# Altium project Telemetry_Board.PrjPcb
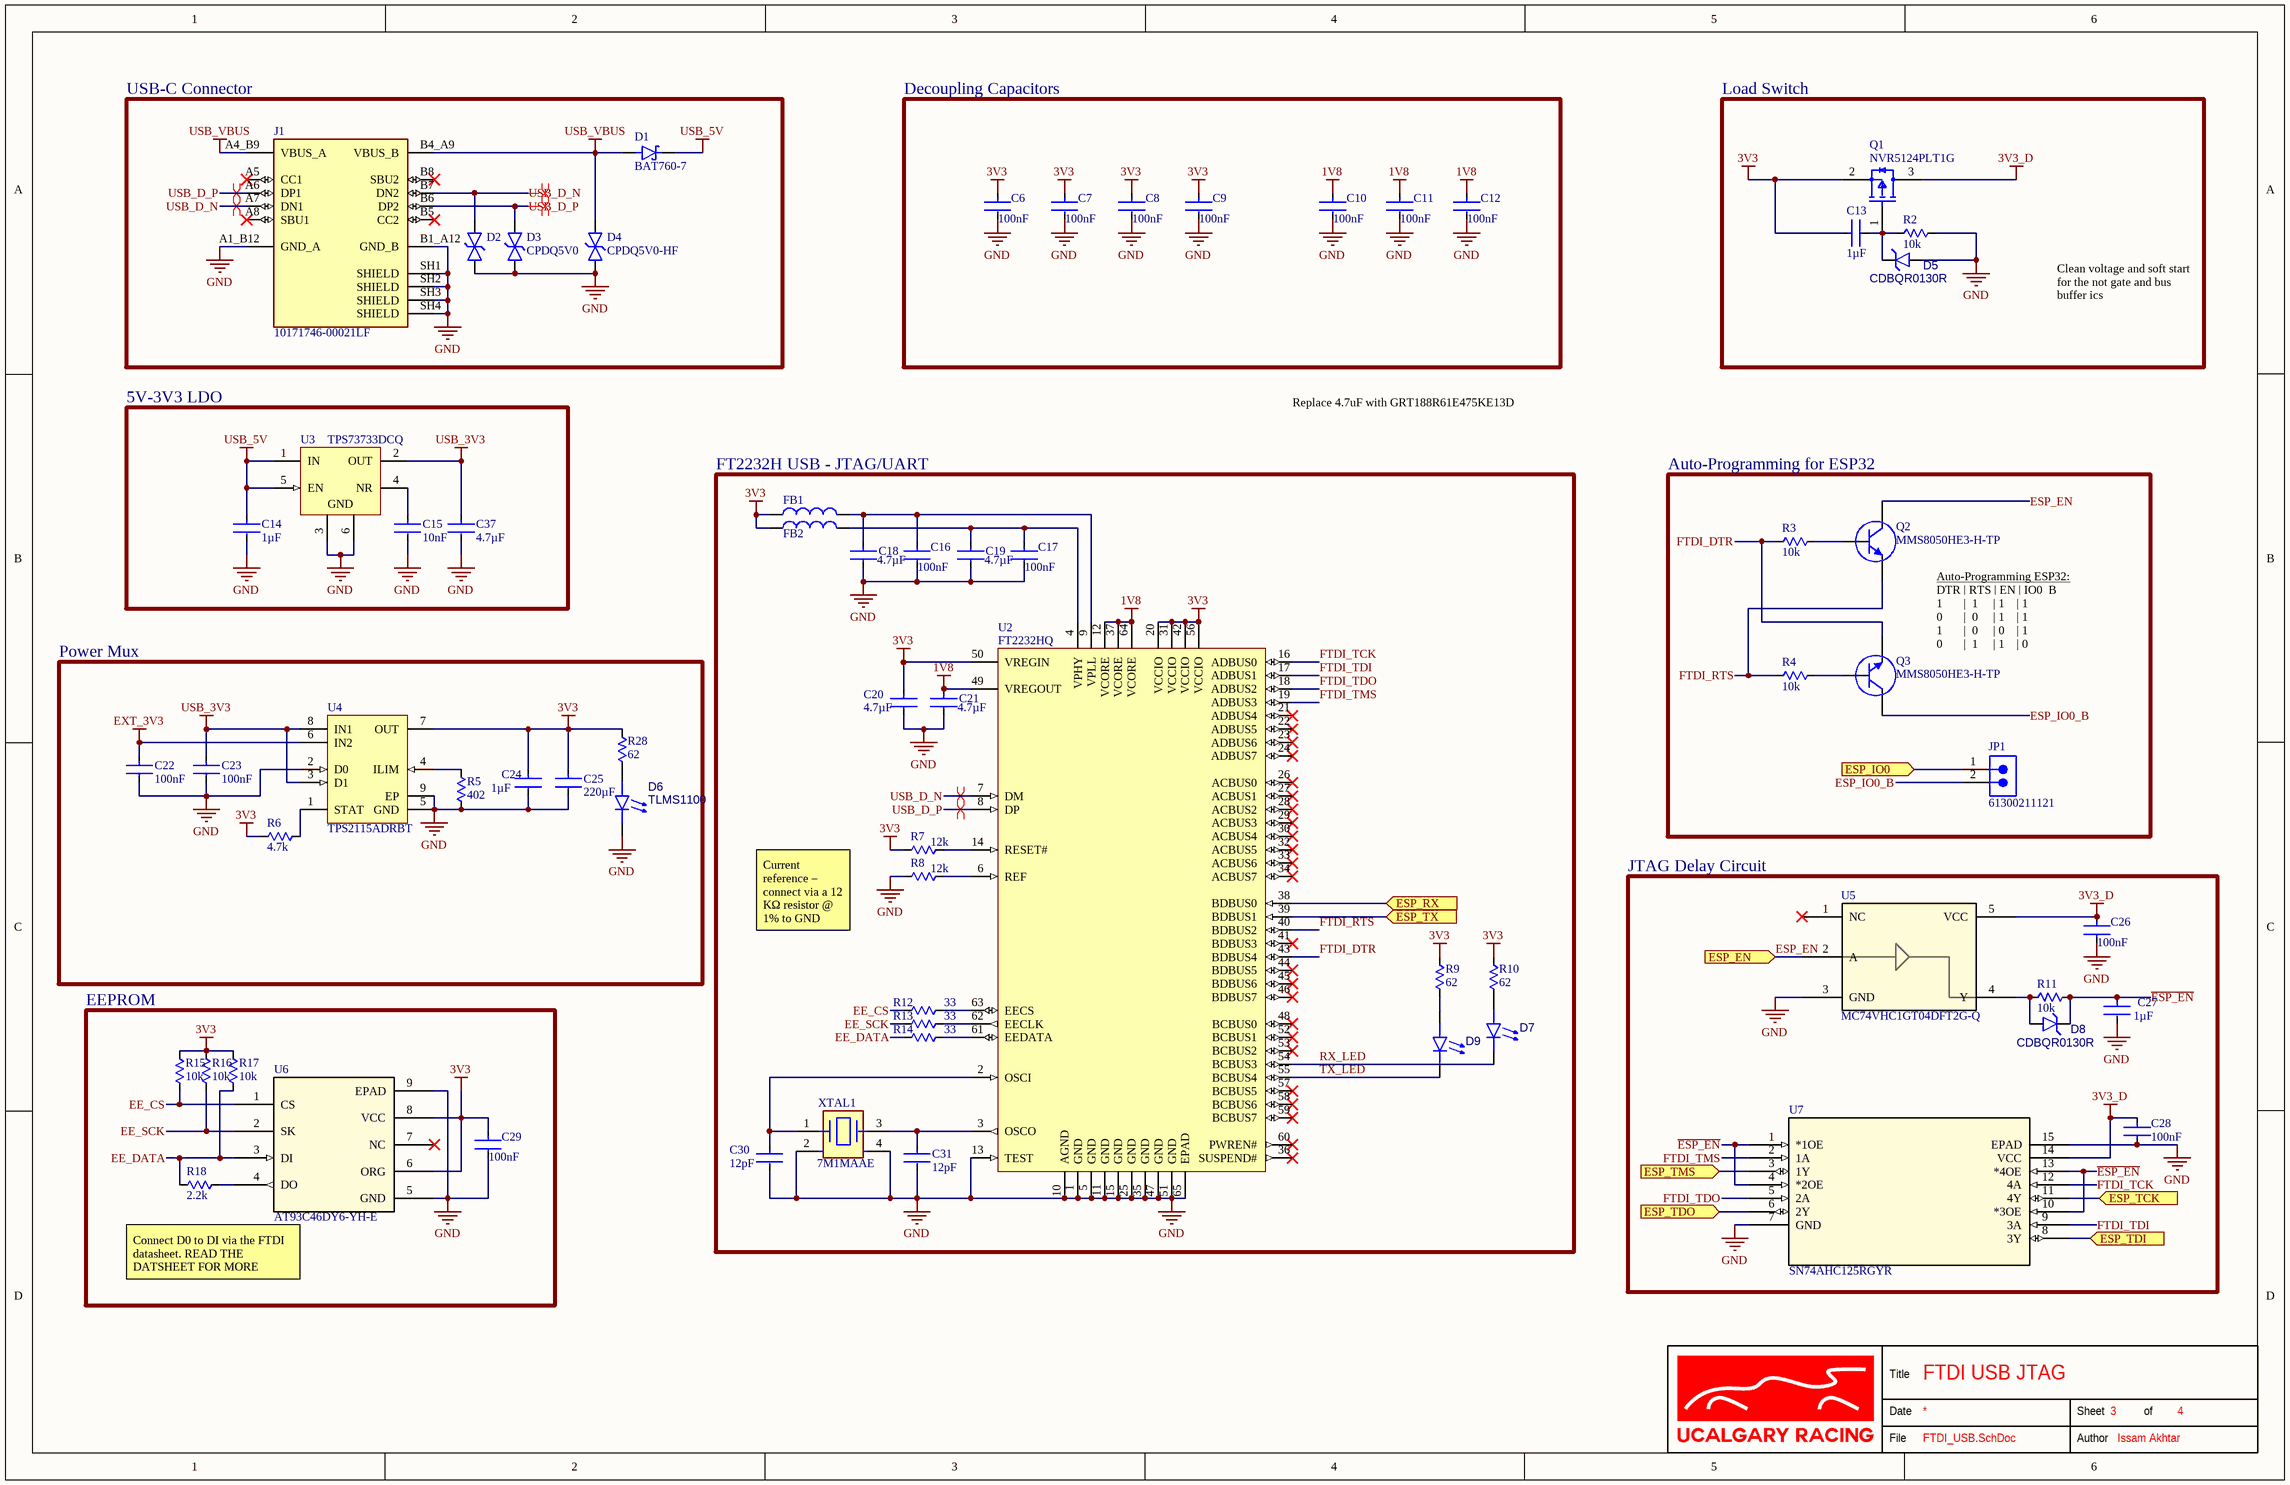
[diagram p0: FTDI_USB.SchDoc]
2 sheets, 87 parts. Net scope: flat (ports and power ports of the same name join across sheets).
Board file: Telemetry_Board.PcbDoc
Sheets:
  FTDI_USB.SchDoc
  CAN_Controller.SchDoc

## Sheet FTDI_USB.SchDoc: FTDI USB JTAG
size 431 x 279 mm; Author: Issam Akhtar; SheetNumber: 3; SheetTotal: 4; SPICEModelCacheJSEMETTS: <root> / <DocumentId>JSEMETTS</DocumentId> / <CacheFrame Number="0"> / <Model Name="emk107b7105_aht" Kind="CKT"> / <Text>* EMK107B7105_AHT     SPICE MODEL  ( General Type ) / *-------------------------------------------------------------------------------------------------------- / * Model Generated by TAIYO YUDEN Corporation (http://www.ty-top.com) / * Version 1.0 / * TAIYO YUDEN Control No. 170508_121019 / * Copyright(c) 2012 TAIYO YUDEN CO.,LTD. All Rights Reserved. / *-------------------------------------------------------------------------------------------------------- / * / * Products Name : Multilayer Ceramic Capacitors / * / * Characteristics : / *     Capacitance : 1 uF , Rated Voltage : 16V , TCC : X7R / *     Case Size : 1.6 x 0.8 / 0.063 x 0.031 [mm/inch] , Thickness : 0.8 / 0.031 [mm/inch] / *     (Conditions: Temperature = 25 degC , DC Bias Current/Voltage = 0A / 0V) / * / * Frequency Range : 40Hz - 3GHz / * / * External Node Assignments : / * / *  1  o---| |---o  2 / * / *-------------------------------------------------------------------------------------------------------- / .SubCkt EMK107B7105_AHT 1 2 / **************************** / C0 1 110 0.80758u / Cm 1 101 0.092139u / C1 101 102 0.1852u / Rc1 101 102 2.7949k / C2 102 103 0.056297u / Rc2 102 103 290.22 / C3 103 110 0.052208u / Rc3 103 110 21.398 / C2m 1 301 0.15431u / C21 301 302 0.36455u / Rc21 301 302 10.682k / C22 302 303 0.40822u / Rc22 302 303 6.1869k / C23 303 304 0.48384u / Rc23 303 304 2.563k / C24 304 305 0.20172u / Rc24 304 305 458.05 / C25 305 306 0.12781u / Rc25 305 306 666.09 / C26 306 307 0.31895u / Rc26 306 307 21.434 / C27 307 308 0.18632u / Rc27 307 308 35.28 / C28 308 309 0.057576u / Rc28 308 309 60.428 / C29 309 110 5787.8p / Rc29 309 110 9.6675 / Rp0 1 110 100Meg / L0 110 120 0.29644n / Lm 120 130 0.15574n / L1 120 121 0.20382n / RL1 121 130 0.16236 / L2 120 122 0.33815n / RL2 122 130 0.3166 / L3 120 123 0.86499n / RL3 123 130 0.84214 / CR 120 124 0.21823u / LR 124 125 0.13885n / RR 125 130 36.232m / CL 130 140 1.9321p / LL 130 140 0.19616n / RL 130 140 44.967 / Rs 140 2 6.428m / **************************** / .ends EMK107B7105_AHT</Text> / </Model> / </CacheFrame> / </root>

### Parts
C6  value 100nF  [FP-CL10-IPC_B]  (hidden comment: CL10B104KB8WPNC)
C7  value 100nF  [FP-CL10-IPC_B]  (hidden comment: CL10B104KB8WPNC)
C8  value 100nF  [FP-CL10-IPC_B]  (hidden comment: CL10B104KB8WPNC)
C9  value 100nF  [FP-CL10-IPC_B]  (hidden comment: CL10B104KB8WPNC)
C10  value 100nF  [FP-CL10-IPC_B]  (hidden comment: CL10B104KB8WPNC)
C11  value 100nF  [FP-CL10-IPC_B]  (hidden comment: CL10B104KB8WPNC)
C12  value 100nF  [FP-CL10-IPC_B]  (hidden comment: CL10B104KB8WPNC)
C13  value 1µF  [FP-CL10-IPC_B]  (hidden comment: CL10B105KA8NNNC)
C14  value 1µF  [FP-0603-L_1_6_0_1-W_0_8_0-IPC_B]  (hidden comment: EMK107B7105KAHT)
C15  value 10nF  [FP-C0603C103K9RACTU-IPC_A]  (hidden comment: C0603C103K9RACTU)
C16  value 100nF  [FP-CL10-IPC_B]  (hidden comment: CL10B104KB8WPNC)
C17  value 100nF  [FP-CL10-IPC_B]  (hidden comment: CL10B104KB8WPNC)
C18  value 4.7µF  [FP-CL10-IPC_B]  (hidden comment: CL10A475KA8NQNC)
C19  value 4.7µF  [FP-CL10-IPC_B]  (hidden comment: CL10A475KA8NQNC)
C20  value 4.7µF  [FP-CL10-IPC_B]  (hidden comment: CL10A475KA8NQNC)
C21  value 4.7µF  [FP-CL10-IPC_B]  (hidden comment: CL10A475KA8NQNC)
C22  value 100nF  [FP-CL10-IPC_B]  (hidden comment: CL10B104KB8WPNC)
C23  value 100nF  [FP-CL10-IPC_B]  (hidden comment: CL10B104KB8WPNC)
C24  value 1µF  [FP-CL10-IPC_B]  (hidden comment: CL10B105KA8NNNC)
C25  value 220µF  [FP-GRM31C-0_3-e0_3_0_9-IPC_C]  (hidden comment: GRM31CR60J227ME11K)
C26  value 100nF  [FP-CL10-IPC_B]  (hidden comment: CL10B104KB8WPNC)
C27  value 1µF  [FP-CL10-IPC_B]  (hidden comment: CL10B105KA8NNNC)
C28  value 100nF  [FP-CL10-IPC_B]  (hidden comment: CL10B104KB8WPNC)
C29  value 100nF  [FP-CL10-IPC_B]  (hidden comment: CL10B104KB8WPNC)
C30  value 12pF  [FP-CL10-IPC_B]  (hidden comment: CL10C120JB81PNC)
C31  value 12pF  [FP-CL10-IPC_B]  (hidden comment: CL10C120JB81PNC)
C37  value 4.7µF  [FP-CL10-IPC_B]  (hidden comment: CL10A475KQ8NNNC)
D1  BAT760-7  [SOD2513X120N]
D2  CPDQ5V0-HF  [CPDQ5V0-HF-Footprint-1]  (value not drawn)
D3  CPDQ5V0  [CPDQ5V0-HF-Footprint-1]
D4  CPDQ5V0-HF  [CPDQ5V0-HF-Footprint-1]
D5  CDBQR0130R  [CDBQR0130R-Footprint-1]
D6  TLMS1100  [TLMS1100-GS15-Footprint-1]
D7  TLMO1100-GS15  [TLMS1100-GS15-Footprint-1]  (value not drawn)
D8  CDBQR0130R  [CDBQR0130R-Footprint-1]
D9  TLMG1100-GS15  [TLMS1100-GS15-Footprint-1]  (value not drawn)
FB1  BLM18SP102SH1D  [FP-BLM18-0_15-t0_8-IPC_C]  (value not drawn)
FB2  BLM18SP102SH1D  [FP-BLM18-0_15-t0_8-IPC_C]  (value not drawn)
J1  10171746-00021LF  [AMPHENOL_10171746-00021LF]
JP1  61300211121  [61300211121]
Q1  NVR5124PLT1G  [FP-318-08-IPC_C]
Q2  MMS8050HE3-H-TP  [MMS8050HE3-H-TP-Footprint-1]
Q3  MMS8050HE3-H-TP  [MMS8050HE3-H-TP-Footprint-1]
R2  value 10k  [FP-CRCW0603-e3-IPC_B]  (hidden comment: CRCW060310K0FKEA)
R3  value 10k  [FP-CRCW0603-e3-IPC_B]  (hidden comment: CRCW060310K0FKEA)
R4  value 10k  [FP-CRCW0603-e3-IPC_B]  (hidden comment: CRCW060310K0FKEA)
R5  value 402  [FP-CRCW0603-e3-IPC_B]  (hidden comment: CRCW0603402RFKEA)
R6  value 4.7k  [FP-CRCW0603-e3-IPC_B]  (hidden comment: CRCW06034K70FKEA)
R7  value 12k  [FP-ERA3A-IPC_B]  (hidden comment: ERA-3AEB123V)
R8  value 12k  [FP-ERA3A-IPC_B]  (hidden comment: ERA-3AEB123V)
R9  value 62  [RESC1508X50N]  (hidden comment: RCS060362R0FKEA)
R10  value 62  [RESC1508X50N]  (hidden comment: RCS060362R0FKEA)
R11  value 10k  [FP-CRCW0603-e3-IPC_B]  (hidden comment: CRCW060310K0FKEA)
R12  value 33  [FP-CRCW0603-e3-IPC_C]  (hidden comment: CRCW060333R0FKEA)
R13  value 33  [FP-CRCW0603-e3-IPC_C]  (hidden comment: CRCW060333R0FKEA)
R14  value 33  [FP-CRCW0603-e3-IPC_C]  (hidden comment: CRCW060333R0FKEA)
R15  value 10k  [FP-CRCW0603-e3-IPC_B]  (hidden comment: CRCW060310K0FKEA)
R16  value 10k  [FP-CRCW0603-e3-IPC_B]  (hidden comment: CRCW060310K0FKEA)
R17  value 10k  [FP-CRCW0603-e3-IPC_B]  (hidden comment: CRCW060310K0FKEA)
R18  value 2.2k  [FP-CRCW0603-e3-IPC_B]  (hidden comment: CRCW06032K20FKEA)
R28  value 62  [RESC1508X50N]  (hidden comment: RCS060362R0FKEA)
U2  FT2232HQ  [FP-FT2232HQ-Reel-MFG]
U3  TPS73733DCQ  [DCQ0006A_N]
U4  TPS2115ADRBT  [DRB0008B_V]
U5  MC74VHC1GT04DFT2G-Q  [MC74VHC1GT04DFT2G-Q-Footprint-1]
U6  AT93C46DY6-YH-E  [AT93C46DY6-YH-E-Footprint-1]
U7  SN74AHC125RGYR  [RGY0014A_V]
XTAL1  7M1MAAE  [FP-7M-MFG]

### Blocks framed on the sheet
USB-C Connector: D1-D4 J1
Decoupling Capacitors: C6-C12
Load Switch: C13 D5 Q1 R2
5V-3V3 LDO: C14 C15 C37 U3
FT2232H USB - JTAG/UART: C16-C21 C30 C31 D7 D9 FB1 FB2 R7-R10 R12-R14 U2 XTAL1
Auto-Programming for ESP32: JP1 Q2 Q3 R3 R4
Power Mux: C22-C25 D6 R5 R6 R28 U4
JTAG Delay Circuit: C26-C28 D8 R11 U5 U7
EEPROM: C29 R15-R18 U6

### Ports
ESP_EN (in, see Telemetry_Module[3C], ESP32[2B], ESP32[3B]), ESP_IO0 (in, see Telemetry_Module[3C], ESP32[2B], ESP32[5B]), ESP_RX (in, see Telemetry_Module[3B], ESP32[5B]), ESP_TCK (in, see Telemetry_Module[3B], ESP32[5B]), ESP_TDI (in, see Telemetry_Module[3B], ESP32[5B]), ESP_TDO (in, see Telemetry_Module[3B], ESP32[5B]), ESP_TMS (in, see Telemetry_Module[3B], ESP32[5B]), ESP_TX (in, see Telemetry_Module[3B], ESP32[5B])

### Nets
1V8: C10.1 C11.1 C12.1 C21.1 U2.12(VCORE) U2.37(VCORE) U2.49(VREGOUT) U2.64(VCORE)
3V3: C6.1 C7.1 C8.1 C9.1 C13.1 C20.1 C24.1 C25.1 C29.1 FB1.1 FB2.1 Q1.2(S) R6.1 R7.1 R9.2 R10.2 R15.2 R16.2 R17.2 R28.2 U2.20(VCCIO) U2.31(VCCIO) U2.42(VCCIO) U2.50(VREGIN) U2.56(VCCIO) U4.7(OUT) U6.6(ORG) U6.8(VCC)
3V3_D: C26.1 C28.1 Q1.3(D) U5.5(VCC) U7.14(VCC)
EXT_3V3: C22.1 U4.6(IN2)
GND: C6.2 C7.2 C8.2 C9.2 C10.2 C11.2 C12.2 C14.2 C15.2 C16.2 C17.2 C18.2 C19.2 C20.2 C21.2 C22.2 C23.2 C24.2 C25.2 C26.2 C27.2 C28.2 C29.2 C30.2 C31.2 C37.2 D2.1(C) D3.1(C) D4.1(C) D5.2(A) D6.1(K) J1.A1_B12(GND_A) J1.B1_A12(GND_B) J1.SH1(SHIELD) J1.SH2(SHIELD) J1.SH3(SHIELD) J1.SH4(SHIELD) R2.1 R5.2 R8.1 U2.1(GND) U2.5(GND) U2.10(AGND) U2.11(GND) U2.13(TEST) U2.15(GND) U2.25(GND) U2.35(GND) U2.47(GND) U2.51(GND) U2.65(EPAD) U3.3(GND) U3.6(GND) U4.2(D0) U4.5(GND) U4.9(EP) U5.3(GND) U6.5(GND) U6.9(EPAD) U7.7(GND) U7.15(EPAD) XTAL1.2(GND) XTAL1.4(GND)
USB_3V3: C23.1 C37.1 U3.2(OUT) U4.3(D1) U4.8(IN1)
USB_5V: C14.1 D1.C(K) U3.1(IN) U3.5(EN)
USB_VBUS: D1.A D4.2(A) J1.A4_B9(VBUS_A) J1.B4_A9(VBUS_B)
~{ESP_EN}: C27.1 D8.1(K) R11.1 U7.1(*1OE) U7.4(*2OE) U7.10(*3OE) U7.13(*4OE)
EE_CS: R12.1 R15.1 U6.1(CS)
EE_DATA: R14.1 R17.1 R18.1 U6.3(DI)
EE_SCK: R13.1 R16.1 U6.2(SK)
ESP_EN: Q2.2(C) U5.2(A) ; port ESP_EN
ESP_IO0_B: JP1.2 Q3.2(C)
FTDI_DTR: Q3.3(E) R3.2 U2.43(BDBUS4)
FTDI_RTS: Q2.3(E) R4.2 U2.40(BDBUS2)
FTDI_TCK: U2.16(ADBUS0) U7.12(4A)
FTDI_TDI: U2.17(ADBUS1) U7.9(3A)
FTDI_TDO: U2.18(ADBUS2) U7.5(2A)
FTDI_TMS: U2.19(ADBUS3) U7.2(1A)
RX_LED: D7.1(K) U2.54(BCBUS3)
TX_LED: D9.1(K) U2.55(BCBUS4)
USB_D_N: D2.2(A) J1.A7(DN1) J1.B7(DN2) U2.7(DM)
USB_D_P: D3.2(A) J1.A6(DP1) J1.B6(DP2) U2.8(DP)
NetC13_2: C13.2 D5.1(K) Q1.1(G) R2.2
NetC15_1: C15.1 U3.4(NR)
NetC16_1: C16.1 C18.1 FB1.2 U2.9(VPLL)
NetC17_1: C17.1 C19.1 FB2.2 U2.4(VPHY)
NetC30_1: C30.1 U2.2(OSCI) XTAL1.1
NetC31_1: C31.1 U2.3(OSCO) XTAL1.3
NetD6_2: D6.2(A) R28.1
NetD7_2: D7.2(A) R10.1
NetD8_2: D8.2(A) R11.2 U5.4(Y)
NetD9_2: D9.2(A) R9.1
NetJP1_1: JP1.1 ; port ESP_IO0
NetQ2_1: Q2.1(B) R3.1
NetQ3_1: Q3.1(B) R4.1
NetR5_1: R5.1 U4.4(ILIM)
NetR6_2: R6.2 U4.1(STAT)
NetR7_2: R7.2 U2.14(RESET#)
NetR8_2: R8.2 U2.6(REF)
NetR12_2: R12.2 U2.63(EECS)
NetR13_2: R13.2 U2.62(EECLK)
NetR14_2: R14.2 U2.61(EEDATA)
NetR18_2: R18.2 U6.4(DO)
NetU2_38: U2.38(BDBUS0) ; port ESP_RX
NetU2_39: U2.39(BDBUS1) ; port ESP_TX
NetU7_3: U7.3(1Y) ; port ESP_TMS
NetU7_6: U7.6(2Y) ; port ESP_TDO
NetU7_8: U7.8(3Y) ; port ESP_TDI
NetU7_11: U7.11(4Y) ; port ESP_TCK

Not connected (* = marked no-connect by the designer): J1 A5(CC1)* A8(SBU1)* B5(CC2)* B8(SBU2)*; U2 21(ADBUS4)* 22(ADBUS5)* 23(ADBUS6)* 24(ADBUS7)* 26(ACBUS0)* 27(ACBUS1)* 28(ACBUS2)* 29(ACBUS3)* 30(ACBUS4)* 32(ACBUS5)* 33(ACBUS6)* 34(ACBUS7)* 36(SUSPEND#)* 41(BDBUS3)* 44(BDBUS5)* 45(BDBUS6)* 46(BDBUS7)* 48(BCBUS0)* 52(BCBUS1)* 53(BCBUS2)* 57(BCBUS5)* 58(BCBUS6)* 59(BCBUS7)* 60(PWREN#)*; U5 1(NC)*; U6 7(NC)*

### Layout directives
differential pair: USB_D_N, USB_D_P

### Notes on the sheet
- Clean voltage and soft start for the not gate and bus buffer ics
- Replace 4.7uF with GRT188R61E475KE13D
- Auto-Programming ESP32:
  DTR | RTS | EN | IO0_B
- 1       |  1     | 1    | 1
  0       |  0     | 1    | 1
  1       |  0     | 0    | 1
  0       |  1     | 1    | 0
- Current reference – connect via a 12 KΩ resistor @ 1% to GND
- Connect D0 to DI via the FTDI datasheet. READ THE DATSHEET FOR MORE
- Title
- Date
- Sheet
- of
- File
- Author

### Library data of the parts
C6-C12 C16 C17 C22 C23 C26 C28 C29 = CMP-001-00005-5: 0.1 µF ±10% 50V Ceramic Capacitor X7R 0603 (1608 Metric); Case/Package: 0603; Min Operating Temperature: -55°C; Mounting Technology: Surface Mount; Pins: 2; Max Operating Temperature: 125°C; Capacitor Type: Ceramic; Voltage Rating: 50V
C13 C24 C27 = CMP-001-00021-3: 1 µF ±10% 25V Ceramic Capacitor X7R 0603 (1608 Metric); RoHS Compliant: Yes; Min Operating Temperature: -55°C; Height: 0.9mm; Capacitor Type: Ceramic; Voltage Rating: 25V; Case/Package: 0603; Tolerance: 10%; Mounting Technology: Surface Mount; Pins: 2; Rated DC Voltage (URdc): 25V; Max Operating Temperature: 125°C
C14 = CMP-001-00032-1: Ceramic Capacitor, Multilayer, Ceramic, 16V, 10% +Tol, 10% -Tol, X7R, 15% TC, 1uF, Surface Mount, 0603; Case/Package: 0603; Pins: 2; Capacitor Type: Ceramic; Max Operating Temperature: 125°C; Mounting Technology: Surface Mount; Min Operating Temperature: -55°C; RoHS Compliant: Yes
C15 = CMP-001-00029-1: Ceramic Capacitor, Multilayer, Ceramic, 6.3V, 10% +Tol, 10% -Tol, X7R, 15% TC, 0.01uF, Surface Mount, 0603; Pins: 2; Capacitor Type: Ceramic; RoHS Compliant: Yes; Min Operating Temperature: -55°C; Max Operating Temperature: 125°C; Case/Package: 0603; Mounting Technology: Surface Mount
C18-C21 = CMP-001-00082-1: Ceramic Capacitor, Multilayer, Ceramic, 25V, 10% +Tol, 10% -Tol, X5R, 15% TC, 4.7uF, Surface Mount, 0603; Case/Package: 0603; Pins: 2; Min Operating Temperature: -55°C; RoHS Compliant: Yes; Mounting Technology: Surface Mount; Capacitor Type: Ceramic; Max Operating Temperature: 85°C
C25 = CMP-001-00087-1: Ceramic Capacitor, Multilayer, Ceramic, 6.3V, 20% +Tol, 20% -Tol, X5R, 15% TC, 220uF, Surface Mount, 1206; Min Operating Temperature: -55°C; Rated DC Voltage (URdc): 6.3V; Max Operating Temperature: 85°C; Pins: 2; Mounting Technology: Surface Mount; Case/Package: 1206; Capacitor Type: Ceramic; RoHS Compliant: Yes
C30 C31 = CMP-001-00083-1: Ceramic Capacitor, Multilayer, Ceramic, 50V, 5% +Tol, 5% -Tol, C0G, -/+30ppm/Cel TC, 0.000012uF, Surface Mount, 0603; Case/Package: 0603; Capacitor Type: Ceramic; Pins: 2; Rated DC Voltage (URdc): 50V; RoHS Compliant: Yes; Min Operating Temperature: -55°C; Max Operating Temperature: 125°C; Mounting Technology: Surface Mount
C37 = CMP-001-00016-4: 4.7 µF ±10% 6.3V Ceramic Capacitor X5R 0603 (1608 Metric); Tolerance: 10%; Mounting Technology: Surface Mount; Min Operating Temperature: -55°C; Voltage Rating: 6.3V; Case/Package: 0603; Max Operating Temperature: 85°C; Capacitor Type: Ceramic; RoHS Compliant: Yes; Pins: 2
D1 = CMP-004-00029-2: Diode Schottky 30V 1A 2-Pin SOD-323 T/R; MF: Diodes Zetex; BuyPart: https://www.snapeda.com/parts/BAT760-7/Zetex/view-part/4817231/?ref=eda; Design Item ID: BAT760-7; Case/Package: None; Mouser-Purchase-URL: https://snapeda.com/shop?store=Mouser&id=4817231; DigiKey-Purchase-URL: https://snapeda.com/shop?store=DigiKey&id=4817231; Component Type: Standard; Price: None; Availability: Good; MP: BAT760-7; Value: *; SnapEDA_Link: https://www.snapeda.com/parts/BAT760-7/Zetex/view-part/4817231/?ref=snap; Pins: 2; Source: BAT760-7.SchLib
D2-D4 = CMP-004-00030-1: Trans Voltage Suppressor Diode, 174W, 5V V(RWM), Bidirectional, 1 Element, Silicon; Breakdown Voltage-Nom: 5.6V; Clamping Voltage-Max: 18.6V; Diode Type: TRANS VOLTAGE SUPPRESSOR; Polarity: Bidirectional; Reach SVHC Compliant: Yes; RoHS Compliant: Yes; Rep Pk Reverse Voltage-Max: 5V
D5 D8 = CMP-004-00031-1: Rectifier Diode, Schottky, 1 Phase, 1 Element, 0.1A, 35V V(RRM), Silicon; Max Output current: 100mA; Forward Voltage: 450mV; Diode Type: RECTIFIER; RoHS Compliant: Yes; Pins: 2; Package Style: SMALL OUTLINEMeter; Max Operating Temperature: 125°C
D6 = CMP-007-00006-1: Single Color LED, Red, 1.6mm; RoHS Compliant: Yes
D7 = CMP-007-00007-1: Led, Orange, 80Mcd, 606Nm, 0603 Rohs Compliant: Yes
D9 = CMP-007-00008-1: Single Color LED, Green, 1.6mm; RoHS Compliant: Yes
FB1 FB2 = CMP-006-00012-1: Ferrite Chip, 1 Function(s), 0.8A, 2 Pin(s)
J1 = CMP-002-00084-1: USB-C (USB TYPE-C) USB 2.0 Receptacle Connector 24 (6+18 Dummy) Position Surface Mount, Right Angle; Through Hole; MF: Amphenol; MP: 10171746-00021LF; Design Item ID: 10171746-00021LF; Component Type: Standard; Case/Package: None; Pins: 16; Check_prices: https://www.snapeda.com/parts/10171746-00021LF/Amphenol/view-part/?ref=eda; Value: *; Source: 10171746-00021LF.SchLib; SnapEDA_Link: https://www.snapeda.com/parts/10171746-00021LF/Amphenol/view-part/?ref=snap
JP1 = CMP-002-00077-1: Board Connector, 2 Contact(s), 1 Row(s), Male, Straight, 0.1 inch Pitch, Solder Terminal, Locking, Black Insulator, Plug; Connector Type: BOARD CONNECTOR; Min Operating Temperature: -40°C; Max Operating Temperature: 125°C; Mounting Technology: Board; RoHS Compliant: Yes
Q1 = CMP-013-00025-1: Small Signal Field-Effect Transistor, 1.1A I(D), 60V, 1-Element, P-Channel, Silicon, Metal-oxide Semiconductor FET, TO-236; RoHS Compliant: Yes
Q2 Q3 = CMP-013-00024-1: NPN Signal Transistor, SOT-23
R2-R4 R11 R15-R17 = CMP-009-00002-2: 10 kOhms ±1% 0.1W, 1/10W Chip Resistor 0603 (1608 Metric) Automotive AEC-Q200 Thick Film; Voltage Rating: 75V; Power: 100mW; Mounting Technology: Surface Mount; Max Operating Temperature: 155°C; Pins: 2; Min Operating Temperature: -55°C; Tolerance: 1%; Case/Package: 0603
R5 = CMP-009-00007-3: 402 Ohms ±1% 0.1W, 1/10W Chip Resistor 0603 (1608 Metric) Automotive AEC-Q200 Thick Film; Power: 100mW; Voltage Rating: 75V; Min Operating Temperature: -55°C; Mounting Technology: Surface Mount; Tolerance: 1%; Max Operating Temperature: 155°C; Pins: 2; Case/Package: 0603; RoHS Compliant: Yes
R6 = CMP-009-00003-3: 4.7 kOhms ±1% 0.1W, 1/10W Chip Resistor 0603 (1608 Metric) Automotive AEC-Q200 Thick Film; Power: 100mW; Voltage Rating: 75V; Max Operating Temperature: 155°C; Min Operating Temperature: -55°C; Mounting Technology: Surface Mount; Pins: 2; Tolerance: 1%; Case/Package: 0603
R7 R8 = CMP-009-00044-3: Fixed Resistor, Thin Film, 0.1W, 12000ohm, 75V, 0.1% +/-Tol, 25ppm/Cel, Surface Mount, 0603; Power: 100mW; Rated Temperature: 85°C; Package Height: 0.45mm; Mounting Technology: Surface Mount; Tolerance: 0.1%; Case/Package: 0603; Working Voltage: 75V; Min Operating Temperature: -55°C; RoHS Compliant: Yes; Max Operating Temperature: 155°C
R9 R10 R28 = CMP-009-00180-2: Case/Package: None; Pins: 2; Component Type: Standard; MP: RCS060362R0FKEA; Design Item ID: RCS060362R0FKEA; Availability: Unavailable; Price: None; Source: RCS060362R0FKEA.SchLib
R12-R14 = CMP-009-00183-1: Fixed Resistor, Metal Glaze/thick Film, 0.1W, 33ohm, 75V, 1% +/-Tol, 100ppm/Cel, Surface Mount, 0603; Power: 100mW; Pins: 2; RoHS Compliant: Yes; Tolerance: 1%; Mounting Technology: Surface Mount; Min Operating Temperature: -55°C; Working Voltage: 75V; Max Operating Temperature: 155°C; Case/Package: 0603
R18 = CMP-009-00147-1: 2.2 kOhms ±1% 0.1W, 1/10W Chip Resistor 0603 (1608 Metric) Automotive AEC-Q200 Thick Film; Voltage Rating: 75V; Power: 100mW; Tolerance: 1%; Case/Package: 0603; Mounting Technology: Surface Mount; Max Operating Temperature: 155°C; Pins: 2; Min Operating Temperature: -55°C; RoHS Compliant: Yes
U2 = CMP-015-00005-2: USB Bus Controller, CMOS, PQCC64; Max Supply Voltage: 1.98V; Min Supply Voltage: 1.62V; Nominal Supply Voltage: 1.8V; Min Operating Temperature: -40°C; Max Operating Temperature: 85°C; RoHS Compliant: Yes; Case/Package: HVQCCN; Pins: 64
U3 = CMP-019-00028-1: Fixed Positive LDO Regulator, 3.3V, 0.5V Dropout, BICMOS, PDSO6; Max Supply Voltage: 5.5V; Case/Package: SOP; RoHS Compliant: Yes; Pins: 6
U4 = CMP-019-00031-1: Power Supply Support Circuit, Adjustable, 2 Channel, PDSO8; Min Supply Voltage: 1.5V; Max Supply Voltage: 5.5V; Min Operating Temperature: -40°C; RoHS Compliant: Yes; Pins: 8; Max Operating Temperature: 85°C; Case/Package: HVSON
U5 = CMP-016-00002-1
U6 = CMP-019-00024-2: EEPROM, 64X16, Serial, CMOS, PDSO8; Max Supply Voltage: 5.5V; Density: 1024b; Serial Bus Type: 3-WIRE; Min Supply Voltage: 4.5V; Operating Mode: SYNCHRONOUS; Number of Words Code: 64; Clock Frequency: 2MHz; Parallel/Serial: SERIAL; Min Operating Temperature: -40°C; Height - Seated (Max): 0.6mm; Max Operating Temperature: 85°C; Memory Format: EEPROM; Organization: 64X16; Package Shape: Rectangular; Case/Package: HVSON; Memory Size: 64; Pins: 8; Length: 3mm
U7 = CMP-00024-00007-1: Bus Driver, AHC/VHC/H/U/V Series, 4-Func, 1-Bit, True Output, CMOS, PQCC14; Min Supply Voltage: 2V; Number of Ports: 2; Control Type: ENABLE LOW; Max I(ol): 8mA; Output Characteristics: 3-STATE; Power Supplies: 2/5.5V; Nominal Supply Voltage: 3.3V; Max Supply Voltage: 5.5V; Channels: 4; Case/Package: HVQCCN; Max Operating Temperature: 125°C; RoHS Compliant: Yes; Output Polarity: True; Package Style: CHIP CARRIER, HEAT SINK/SLUG, VERY THIN PROFILEMeter; Min Operating Temperature: -40°C; Pins: 14; Logic Type: BUS DRIVER
XTAL1 = CMP-003-00001-1: Parallel - Fundamental Quartz Crystal, 12MHz Nom; Load Capacitance: 12pF; Aging: 3 PPM/YEAR; Frequency Tolerance: 30ppm; Frequency Stability: 0.003%; Drive Level: 1uW; ESR: 100; Max Operating Temperature: 70°C; Min Operating Temperature: -20°C; Mounting Technology: Surface Mount; RoHS Compliant: Yes; Crystal/Resonator Type: PARALLEL - FUNDAMENTAL

## Sheet CAN_Controller.SchDoc
size 279 x 215 mm; SheetNumber: 4; SheetTotal: 4
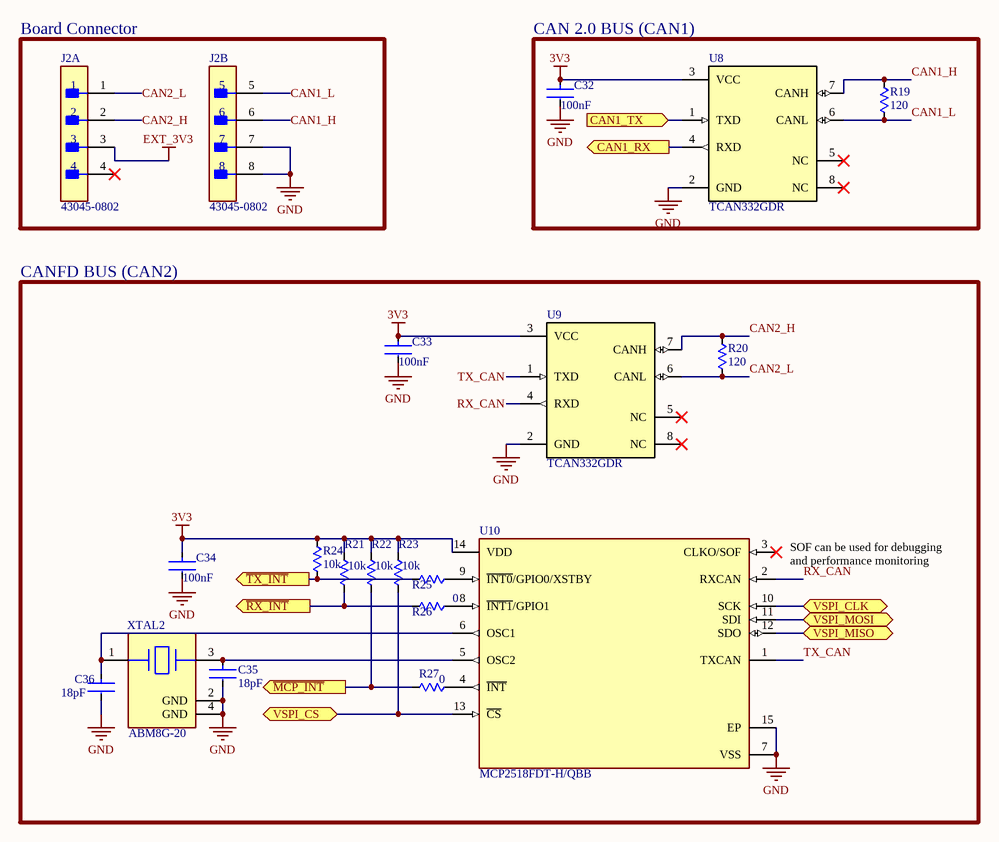
[diagram p1: CAN_Controller.SchDoc]

### Parts
C32  value 100nF  [FP-CL10-IPC_B]  (hidden comment: CL10B104KB8WPNC)
C33  value 100nF  [FP-CL10-IPC_B]  (hidden comment: CL10B104KB8WPNC)
C34  value 100nF  [FP-CL10-IPC_B]  (hidden comment: CL10B104KB8WPNC)
C35  value 18pF  [FP-C0402-BB-MFG]  (hidden comment: C0402C180J3GACAUTO)
C36  value 18pF  [FP-C0402-BB-MFG]  (hidden comment: C0402C180J3GACAUTO)
J2  43045-0802  [FP-43045-0802-MFG]  (parts A,B of 2)
R19  value 120  [FP-CRCW0603-e3-IPC_B]  (hidden comment: CRCW0603120RFKTA)
R20  value 120  [FP-CRCW0603-e3-IPC_B]  (hidden comment: CRCW0603120RFKTA)
R21  value 10k  [FP-CRCW0603-e3-IPC_B]  (hidden comment: CRCW060310K0FKEA)
R22  value 10k  [FP-CRCW0603-e3-IPC_B]  (hidden comment: CRCW060310K0FKEA)
R23  value 10k  [FP-CRCW0603-e3-IPC_B]  (hidden comment: CRCW060310K0FKEA)
R24  value 10k  [FP-CRCW0603-e3-IPC_B]  (hidden comment: CRCW060310K0FKEA)
R25  CRCW06030000Z0EA  [FP-CRCW0603-e3-IPC_B]  (value not drawn)
R26  value 0  [FP-CRCW0603-e3-IPC_B]  (hidden comment: CRCW06030000Z0EA)
R27  value 0  [FP-CRCW0603-e3-IPC_B]  (hidden comment: CRCW06030000Z0EA)
U8  TCAN332GDR  [TCAN332GDR-Footprint-1]
U9  TCAN332GDR  [TCAN332GDR-Footprint-1]
U10  MCP2518FDT-H/QBB  [FP-C04-21361-IPC_A]
XTAL2  ABM8G-20  [FP-ABM8G-MFG]

### Blocks framed on the sheet
Board Connector: J2
CAN 2.0 BUS (CAN1): C32 R19 U8
CANFD BUS (CAN2): C33-C36 R20-R27 U9 U10 XTAL2

### Ports
CAN1_RX (out, see Telemetry_Module[4B], ESP32[5B]), CAN1_TX (in, see Telemetry_Module[4B], ESP32[5B]), VSPI_CLK (bidir, see Telemetry_Module[4C], ESP32[5B]), VSPI_CS (bidir, see Telemetry_Module[4C], ESP32[5B]), VSPI_MISO (bidir, see Telemetry_Module[4B], ESP32[5B]), VSPI_MOSI (bidir, see Telemetry_Module[4B], ESP32[5B]), ~{MCP_INT} (out, see Telemetry_Module[4C], ESP32[5C]), ~{RX_INT} (out, see Telemetry_Module[4C], ESP32[5C]), ~{TX_INT} (out, see Telemetry_Module[4C], ESP32[5C])

### Nets
3V3: C32.1 C33.1 C34.1 R21.2 R22.2 R23.2 R24.2 U8.3(VCC) U9.3(VCC) U10.14(VDD)
EXT_3V3: J2.3
GND: C32.2 C33.2 C34.2 C35.2 C36.2 J2.7 J2.8 U8.2(GND) U9.2(GND) U10.7(VSS) U10.15(EP) XTAL2.2(GND) XTAL2.4(GND)
CAN1_H: J2.6 R19.2 U8.7(CANH)
CAN1_L: J2.5 R19.1 U8.6(CANL)
CAN2_H: J2.2 R20.2 U9.7(CANH)
CAN2_L: J2.1 R20.1 U9.6(CANL)
RX_CAN: U9.4(RXD) U10.2(RXCAN)
TX_CAN: U9.1(TXD) U10.1(TXCAN)
NetC35_1: C35.1 U10.5(OSC2) XTAL2.3
NetC36_1: C36.1 U10.6(OSC1) XTAL2.1
NetR21_1: R21.1 R26.1 ; port ~{RX_INT}
NetR22_1: R22.1 R27.1 ; port ~{MCP_INT}
NetR23_1: R23.1 U10.13(~{CS}) ; port VSPI_CS
NetR24_1: R24.1 R25.1 ; port ~{TX_INT}
NetR25_2: R25.2 U10.9(~{INT0}/GPIO0/XSTBY)
NetR26_2: R26.2 U10.8(~{INT1}/GPIO1)
NetR27_2: R27.2 U10.4(~{INT})
NetU8_1: U8.1(TXD) ; port CAN1_TX
NetU8_4: U8.4(RXD) ; port CAN1_RX
NetU10_10: U10.10(SCK) ; port VSPI_CLK
NetU10_11: U10.11(SDI) ; port VSPI_MOSI
NetU10_12: U10.12(SDO) ; port VSPI_MISO

Not connected (* = marked no-connect by the designer): J2 4*; U8 5(NC)* 8(NC)*; U9 5(NC)* 8(NC)*; U10 3(CLKO/SOF)*

### Notes on the sheet
- (near U10) SOF can be used for debugging and performance monitoring
- Title
- Date
- Sheet
- of
- File
- Author

### Library data of the parts
C32-C34 = CMP-001-00005-5: as C6 on sheet FTDI_USB; Case/Package: 0603; Min Operating Temperature: -55°C; Mounting Technology: Surface Mount; Pins: 2; Max Operating Temperature: 125°C; Capacitor Type: Ceramic; Voltage Rating: 50V
C35 C36 = CMP-001-00084-1: Ceramic Capacitor, Multilayer, Ceramic, 25V, 5% +Tol, 5% -Tol, C0G, 30ppm/Cel TC, 0.000018uF, Surface Mount, 0402; Case/Package: 0402; Min Operating Temperature: -55°C; Capacitor Type: Ceramic; Pins: 2; Mounting Technology: Surface Mount; RoHS Compliant: Yes; Max Operating Temperature: 125°C
J2 = CMP-002-00068-1: CONN HEADER R/A 8POS 3MM; Connector Type: Power,Rectangular; RoHS Compliant: Yes; Mounting Technology: Board; Min Operating Temperature: -40°C; Pins: 8; Max Operating Temperature: 105°C
R19 R20 = CMP-009-00163-1: 120 Ohms ±1% 0.1W, 1/10W Chip Resistor 0603 (1608 Metric) Automotive AEC-Q200 Thick Film; Power: 100mW; RoHS Compliant: No; Case/Package: 0603; Min Operating Temperature: -55°C; Mounting Technology: Surface Mount; Max Operating Temperature: 155°C; Pins: 2; Tolerance: 1%
R21-R24 = CMP-009-00002-2: as R2 on sheet FTDI_USB; Mounting Technology: Surface Mount; Max Operating Temperature: 155°C; Pins: 2; Min Operating Temperature: -55°C; Tolerance: 1%; Case/Package: 0603
R25-R27 = CMP-009-00025-3: 0 Ohms Jumper Chip Resistor 0603 (1608 Metric) Automotive AEC-Q200 Thick Film; Voltage Rating: 75V; Case/Package: 0603; Min Operating Temperature: -55°C; Max Operating Temperature: 155°C
U8 U9 = CMP-015-00000-4: 3.3-V CAN Transceiver with CAN FD; Nominal Supply Voltage: 3.3V; Pins: 8; Min Operating Temperature: -40°C; RoHS Compliant: Yes; Case/Package: SOIC; Max Operating Temperature: 125°C
U10 = CMP-015-00008-1: 1 Channel(s), 8MBps, CMOS, PDCC14; RoHS Compliant: Yes
XTAL2 = CMP-003-00003-1: Crystal 20MHz ±20ppm (Tol) ±30ppm (Stability) 18pF FUND 80Ohm 4-Pin Ultra Mini-CSMD T/R

## Nets that join several sheets
3V3: FTDI_USB (28 pins), CAN_Controller (10 pins)
EXT_3V3: FTDI_USB (C22.1 U4.6), CAN_Controller (J2.3)
GND: FTDI_USB (63 pins), CAN_Controller (13 pins)